# Altium schematic sheet Power.SchDoc
size 259 x 167 mm; SheetNumber: 4; SheetTotal: 5
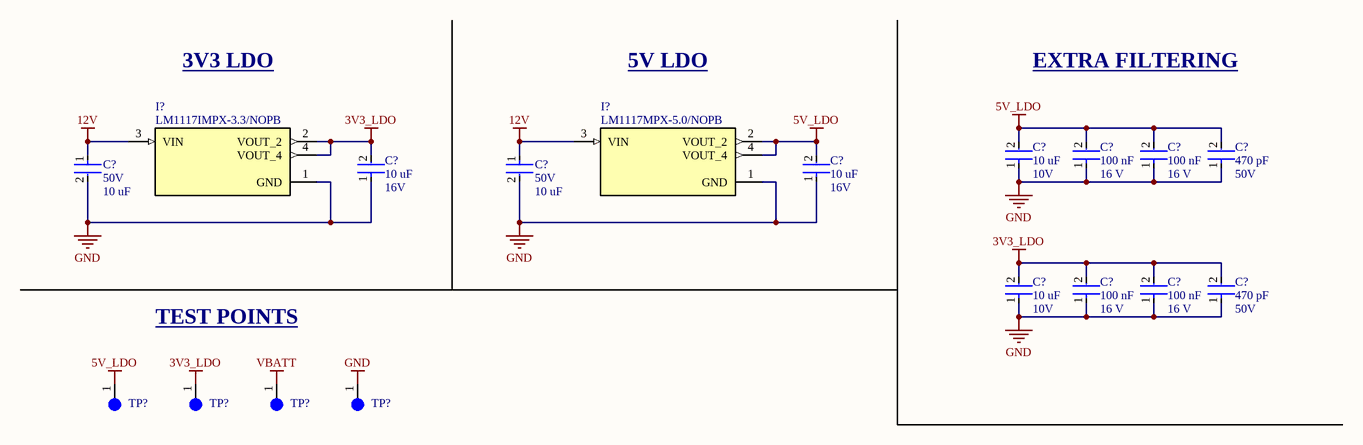
[diagram p0: Power.SchDoc]

## Parts
(Parts that share a designator on the sheet are numbered #1, #2 ... from top to bottom, then left to right.)
C?#1  Voltage: 50V  Capacitance: 10 uF  [CAP-1210]  (hidden comment: CL32B106KBJNNNE)
C?#2  Voltage: 50V  Capacitance: 10 uF  [CAP-1210]  (hidden comment: CL32B106KBJNNNE)
C?#3  Voltage: 10V  Capacitance: 10 uF  [CAP-0603]  (hidden comment: CC0603KRX5R6BB106)
C?#4  Voltage Rating: 16 V  Capacitance: 100 nF  [CAP-0402]  (hidden comment: CC0402KRX7R7BB104)
C?#5  Voltage Rating: 16 V  Capacitance: 100 nF  [CAP-0402]  (hidden comment: CC0402KRX7R7BB104)
C?#6  Voltage: 50V  Capacitance: 470 pF  [CAP-0805]  (hidden comment: CC0805JRNPO9BN471)
C?#7  Voltage: 16V  Capacitance: 10 uF  [CAP-1210]  (hidden comment: 293D106X9016A2TE3)
C?#8  Voltage: 16V  Capacitance: 10 uF  [CAP-1210]  (hidden comment: 293D106X9016A2TE3)
C?#9  Voltage: 10V  Capacitance: 10 uF  [CAP-0603]  (hidden comment: CC0603KRX5R6BB106)
C?#10  Voltage Rating: 16 V  Capacitance: 100 nF  [CAP-0402]  (hidden comment: CC0402KRX7R7BB104)
C?#11  Voltage Rating: 16 V  Capacitance: 100 nF  [CAP-0402]  (hidden comment: CC0402KRX7R7BB104)
C?#12  Voltage: 50V  Capacitance: 470 pF  [CAP-0805]  (hidden comment: CC0805JRNPO9BN471)
I?#1  LM1117IMPX-3.3/NOPB  [IC-SOT-223-4]
I?#2  LM1117MPX-5.0/NOPB  [IC-SOT-223-4]
TP?#1  5003  [TEST-POINT-0001]  (value not drawn)
TP?#2  5003  [TEST-POINT-0001]  (value not drawn)
TP?#3  5003  [TEST-POINT-0001]  (value not drawn)
TP?#4  5003  [TEST-POINT-0001]  (value not drawn)

## Nets
3V3_LDO: C?#7.2 C?#9.2 C?#10.2 C?#11.2 C?#12.2 I?#1.2(VOUT_2) I?#1.4(VOUT_4) TP?#2.1
5V_LDO: C?#3.2 C?#4.2 C?#5.2 C?#6.2 C?#8.2 I?#2.2(VOUT_2) I?#2.4(VOUT_4) TP?#1.1
12V: C?#1.1 C?#2.1 I?#1.3(VIN) I?#2.3(VIN)
GND: C?#1.2 C?#2.2 C?#3.1 C?#4.1 C?#5.1 C?#6.1 C?#7.1 C?#8.1 C?#9.1 C?#10.1 C?#11.1 C?#12.1 I?#1.1(GND) I?#2.1(GND) TP?#4.1
VBATT: TP?#3.1

## Notes on the sheet
- 3V3 LDO
- 5V LDO
- EXTRA FILTERING
- TEST POINTS

## Library data of the parts
C?#1 C?#2 = CAP-10U-0002: CAP CER 10UF 50V X7R 1210; Device Class: Ceramic; Size: 1210; ComponentLink1Description: Datasheet; ComponentLink1URL: https://mm.digikey.com/Volume0/opasdata/d220001/medias/docus/41/CL32B106KBJNNNE_Spec.pdf
C?#3 C?#9 = CAP-10U-0001: CAP CER 10UF 10V X5R 0603; ComponentLink1Description: Datasheet; ComponentLink1URL: https://www.yageo.com/upload/media/product/app/datasheet/mlcc/upy-gphc_x5r_4v-to-50v.pdf; Device Class: Ceramic; Size: 0603
C?#4 C?#5 C?#10 C?#11 = CAP-0.1U-0001: CAP CER 0.1UF 16V X7R 0402; ComponentLink2Description: Datasheet; ComponentLink2URL: https://www.yageo.com/upload/media/product/productsearch/datasheet/mlcc/UPY-GPHC_X7R_6.3V-to-250V_24.pdf; Device Class: Ceramic; Size: 0402
C?#6 C?#12 = CAP-470P-0001: CAP CER 470PF 50V C0G/NPO 0805; Device Class: Ceramic; Size: 0805; ComponentLink1Description: Datasheet; ComponentLink1URL: https://www.yageo.com/upload/media/product/productsearch/datasheet/mlcc/UPY-GP_NP0_16V-to-50V_18.pdf
C?#7 C?#8 = CAP-10U-0003: CAP TANT 10UF 10% 16V 1206; Device Class: Tantalum; Size: 1206; ComponentLink1Description: Datasheet; ComponentLink1URL: https://www.lcsc.com/datasheet/lcsc_datasheet_2304140030_Vishay-Intertech-293D106X9016A2TE3_C110038.pdf
I?#1 = IC_LDO_3V3_0001: IC REG LIN 3.3V 800MA SOT223-4; ComponentLink1Description: New link; ComponentLink1URL: https://www.ti.com/lit/ds/symlink/lm1117.pdf?HQS=dis-dk-null-digikeymode-dsf-pf-null-wwe&ts=1721700739746
I?#2 = IC_LDO_5V_0001: IC REG LINEAR 5V 800MA SOT223-4; ComponentLink1Description: Datasheet; ComponentLink1URL: https://www.ti.com/lit/ds/symlink/lm1117.pdf?HQS=dis-dk-null-digikeymode-dsf-pf-null-wwe&ts=1721700739746
TP?#1-TP?#4 = TEST-POINT-0001: Oranange PC Test Point, Miniature Phoisphor Bronze Silver Plating Through Hole Mounting Type